# Altium schematic sheet Mircod_TEST_LIST_3.SchDoc
size A4
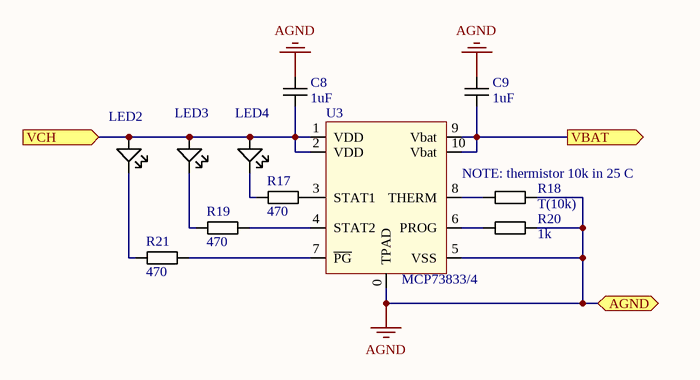
[diagram p0: Mircod_TEST_LIST_3.SchDoc]

## Parts
C8  1uF  [CSMD_0603]
C9  1uF  [CSMD_0603]
LED2  LED  [GDSMD_0603]  (value not drawn)
LED3  LED  [GDSMD_0603]  (value not drawn)
LED4  LED  [BDSMD_0603]  (value not drawn)
R17  470  [SMD_0603]
R18  T(10k)  [SMD_0603]
R19  470  [SMD_0603]
R20  1k  [SMD_0603]
R21  470  [SMD_0603]
U3  MCP73833/4  [10-Lead, 3mm x 3mm DFN]

## Ports
AGND, VBAT (out), VCH (in)

## Nets
AGND: C8.1 C9.1 R18.1 R20.1 U3.0(TPAD) U3.5(VSS) ; port AGND
VBAT: C9.2 U3.9(Vbat) U3.10(Vbat) ; port VBAT
VCH: C8.2 LED2.1 LED3.1 LED4.1 U3.1(VDD) U3.2(VDD) ; port VCH
NetLED2_2: LED2.2 R21.2
NetLED3_2: LED3.2 R19.2
NetLED4_2: LED4.2 R17.2
NetR17_1: R17.1 U3.3(STAT1)
NetR18_2: R18.2 U3.8(THERM)
NetR19_1: R19.1 U3.4(STAT2)
NetR20_2: R20.2 U3.6(PROG)
NetR21_1: R21.1 U3.7(~{PG})

## Notes on the sheet
- NOTE: thermistor 10k in 25 C

## Library data of the parts
C8 C9 = C_SMD: CAPACITOR
R17-R21 = R_SMD: RESISTOR
U3 = MCP73833/4: Stand-Alone Linear Li-Ion / Li-Polymer Charge  Management Controller